# Altium schematic sheet programmer-shield.SchDoc
size Letter; LAST_DATE_TIME: 5/16/2020 2:17:56 PM; SHEET: 1; DRAWING_NAME: programmer-shield; LAST_DATE_TIME: 5/16/2020 2:17:56 PM; DRAWING_NAME: programmer-shield; Address4: USA; DocumentNumber: 1; SheetNumber: 1; SheetTotal: 1; DescLong1: Adapter for Spark Core to ARM Cortex Header; DescLong2_DescShort: Also features a VCOM/Power Header; DescLong3: Designed for Spark Core or Photon V1
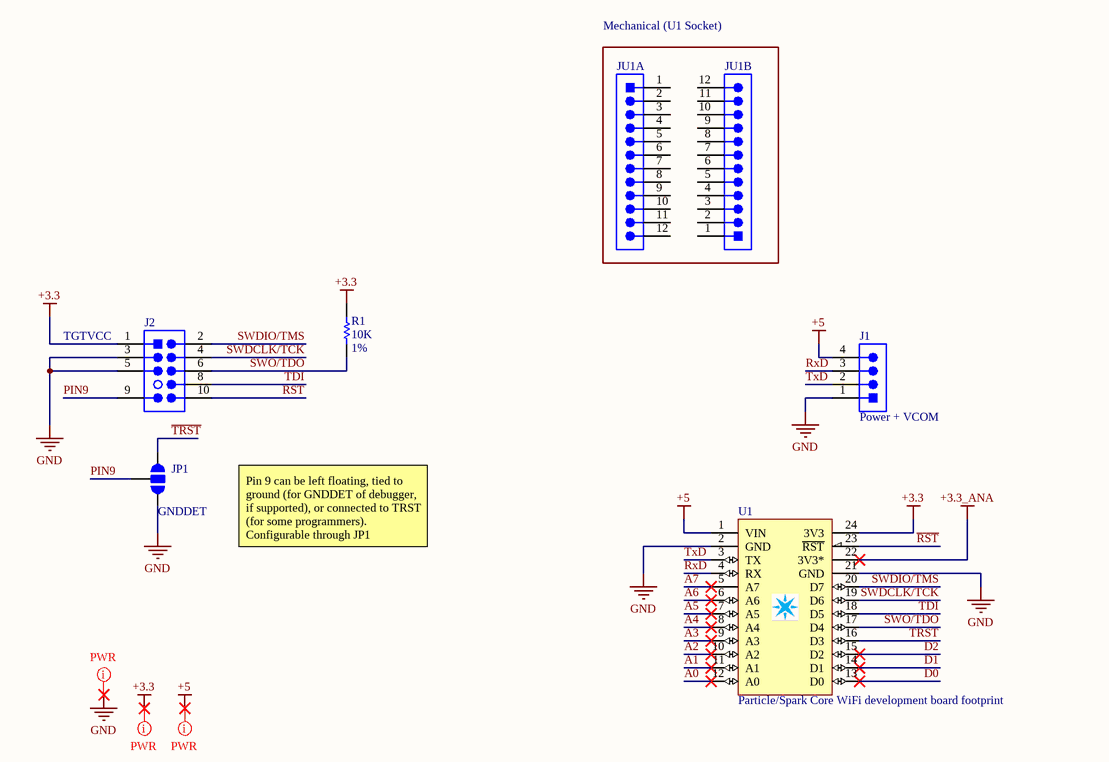
[diagram p0: programmer-shield.SchDoc]

## Parts
J1  4 contacts Male header  [70553-0003]  (value not drawn)
J2  Cortex Debug, 0.050" 10 Pin  [FTSH-105-01-F-DV-007-K PLUGIN]  (value not drawn)
JP1  SMD JMP 3 Pad  [SMT-JUMPER_3_NO_SILK]  (value not drawn)  (no BOM)
JU1A  12 contacts Female header  [SSW-112-01-G-S]  (value not drawn)  (mechanical)
JU1B  12 contacts Female header  [SSW-112-01-G-S]  (value not drawn)  (mechanical)
R1  Val: 10K  Tol: 1%  [0603_RES]  (hidden comment: RES 0603 10K 1%)
U1  Particle/Spark Core WiFi development board footprint  [SPARK_CORE_STACKING_SOCKET]

## Blocks framed on the sheet
Mechanical (U1 Socket): JU1A JU1B

## Nets
+3.3: J2.1(VCC) R1.2 U1.24(3V3)
+3.3_ANA: U1.22(3V3*)
+5: J1.4 U1.1(VIN)
GND: J1.1 J2.3(GND) J2.5(GND) JP1.3 U1.2(GND) U1.21(GND)
~{RST}: J2.10(~{RESET}) U1.23(~{RST})
~{TRST}: JP1.1 U1.16(D3)
A0: U1.12(A0)
A1: U1.11(A1)
A2: U1.10(A2)
A3: U1.9(A3)
A4: U1.8(A4)
A5: U1.7(A5)
A6: U1.6(A6)
A7: U1.5(A7)
D0: U1.13(D0)
D1: U1.14(D1)
D2: U1.15(D2)
PIN9: J2.9(GNDDetect) JP1.2
RxD: J1.3 U1.4(RX)
SWDCLK/TCK: J2.4(SWDCLK/TCK) U1.19(D6)
SWDIO/TMS: J2.2(SWDIO/TMS) U1.20(D7)
SWO/TDO: J2.6(SWO/TDO) R1.1 U1.17(D4)
TDI: J2.8(NC/TDI) U1.18(D5)
TxD: J1.2 U1.3(TX)

Not connected (* = marked no-connect by the designer): JU1A 1 2 3 4 5 6 7 8 9 10 11 12; JU1B 1 2 3 4 5 6 7 8 9 10 11 12

## Layout directives
net class Power: +3.3, +5, GND

## Notes on the sheet
- (near J2) TGTVCC
- (near J1) Power + VCOM
- (near JP1) GNDDET
- Pin 9 can be left floating, tied to ground (for GNDDET of debugger, if supported), or connected to TRST (for some programmers). Configurable through JP1
- Labels drawn without touching a wire or pin: +3.3, +5, GND
- Title:
- Desc:
- Size:
- Date:
- File:
- Repo:
- Letter
- Auth:
- Time:
- Sheet
- Proj:
- of

## Library data of the parts
J1 = 70553-0003: Connector Male Header 1X4 horizontal 4contacts 0.100in pitch Gold finish shrouded; Manufacturer: Molex; PCB Package: NON-STD TH; Description in Visual: Con Hdr Male 4contacts horizontal 1X4; Number of Contacts: 4; P/N: 70553-0003; Manufacturer P/N: 70553-0003; Orientation: horizontal; Number of Rows: 1.00; Pitch: 0.100in; Contact Finish: Gold; Gender: Male; Options: shrouded; ComponentLink1Description: Manufacturer Website; ComponentLink1URL: http://www.molex.com; ComponentLink2Description: Component Datasheet; ComponentLink2URL: http://www.molex.com/pdm_docs/sd/705530002_sd.pdf; ComponentLink4Description: Product Page; ComponentLink4URL: http://www.molex.com/molex/products/datasheet.jsp?part=active/0705530003_PCB_HEADERS.xml; ComponentLink3Description: Octopart Link; ComponentLink3URL: http://octopart.com/partsearch/#search/requestData&q=70553-0003; Supplier 1: Digi-Key; Supplier Part Number 1: WM4902-ND; Supplier Part Number 2: WM4902-ND; Supplier 2: Digi-Key
J2 = ARM Cortex Debug: 10 Pin Shrouded Header, 0.050", Key Pin 7; Manufacturer: Samtech; Manufacturer P/N: Various; Number of Contacts: 10; Gender: Male; P/N: ARM Cortex Debug; Description in Visual: 10 Pin Shrouded Header, 0.050", Key Pin 7; Orientation: Vertical; Number of Rows: 2; Pitch: 0.050"; Contact Finish: Gold; ComponentLink1Description: Pinout Reference; ComponentLink1URL: http://infocenter.arm.com/help/topic/com.arm.doc.faqs/attached/13634/cortex_debug_connectors.pdf; Supplier 3: Digi-Key; Supplier Part Number 3: SAM11250-ND; Supplier 1: Digi-Key; Supplier Part Number 1: SAM15640-ND; Supplier 2: Digi-Key; Supplier Part Number 2: SAM13926CT-ND; ComponentLink2Description: Datasheet for Connector; ComponentLink2URL: http://suddendocs.samtec.com/catalog_english/ftsh_smt.pdf
JP1 = 3 pad Jumper, Open: Normally open jumper    This jumper has three pads in close proximity to each other. Apply solder to close the connection(s).; Description in Visual: Normally open jumper    This jumper has three pads in close proximity to each other. Apply solder to close the connection(s).the cut area.  Seal the cut with an approved epoxy.       Reapply solder to reclose the connection, or to close the NO connection.; P/N: 3 pad Jumper, Open; Manufacturer: N/A; Manufacturer P/N: N/A
JU1A JU1B = SSW-112-01-G-S: Connector Female Header 1X12 vertical 12 contacts  pitch Gold finish; Manufacturer: SamTec; Description in Visual: Con Hdr Female 12 contacts vertical 1X12; Number of Contacts: 12; P/N: SSW-112-01-G-S; Manufacturer P/N: SSW-112-01-G-S; Orientation: vertical; Number of Rows: 1.00; Contact Finish: Gold; Gender: Female; ComponentLink1Description: Manufacturer Website; ComponentLink1URL: https://www.samtec.com; ComponentLink2Description: Component Datasheet; ComponentLink2URL: http://suddendocs.samtec.com/catalog_english/ssw_th.pdf; ComponentLink3Description: Octopart Link; ComponentLink3URL: https://octopart.com/ssw-112-01-g-s-003-samtec-15802181?r=sp; Supplier 1: Digi-Key; Supplier Part Number 1: SAM1209-12-ND
R1 = RES 0603 10K 1%: Resistor Surface Mount, 10K Ohms, 0603 Footprint, 1% Tolerance 0.1W; Manufacturer: Various; PCB Package: 0603; Description in Visual: Res SMT 10K 0603  1%  0.1W; P/N: RES 0603 10K 1%; Manufacturer P/N: Various; Value: 10K; Power_Rating: 0.1W; Tolerance: 1%; Supplier 1: Digi-Key; Supplier Part Number 1: P10.0KHCT-ND; Supplier 2: Digi-Key; Supplier Part Number 2: 541-10.0KHCT-ND; Supplier 3: Newark; Supplier Part Number 3: 68R0128; Supplier 4: Digi-Key; Supplier Part Number 4: A106048CT-ND
U1 = SPARK_CORE